# Altium schematic sheet Storage.SchDoc
size A; SheetNumber: 5; SheetTotal: 7
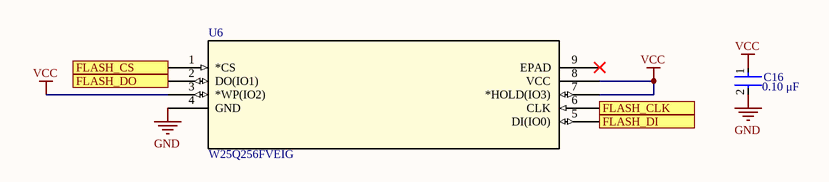
[diagram p0: Storage.SchDoc]

## Parts
C16  Capacitance: 0.10 μF  [FP-C0603C-CF-MFG]  (hidden comment: C0603C104K5RACTU)
U6  W25Q256FVEIG  [WIN_E-8_WIN]

## Ports
FLASH_CLK (in), FLASH_CS (in), FLASH_DI (in), FLASH_DO (out)

## Nets
GND: C16.2 U6.4(GND)
VCC: C16.1 U6.3(*WP(IO2)) U6.7(*HOLD(IO3)) U6.8(VCC)
FLASH_CLK: U6.6(CLK) ; port FLASH_CLK
FLASH_CS: U6.1(*CS) ; port FLASH_CS
FLASH_DI: U6.5(DI(IO0)) ; port FLASH_DI
FLASH_DO: U6.2(DO(IO1)) ; port FLASH_DO

Not connected (* = marked no-connect by the designer): U6 9(EPAD)*

## Library data of the parts
C16 = CMP-2006-03061-2: CAP CER 0.1UF 50V X7R 0603; Manufacturer: KEMET; Tolerance: 0.1; Temperature Coefficient: 30ppm/°C; Material: Ceramic; Automotive Grade: Grade 1; Value: 0.10 μF; Temperature: -55°C to +125°C; RoHS: TRUE; Temperature Range High: +125°C; Lead Free: Yes; Octopart: https://octopart.com/c0603c104k5ractu-kemet-139244; Digikey Description: CAP CER 0.1UF 50V X7R 0603; Category: Cap; Package: C0603C-CF; ComponentLink2Description: Datasheet; Temperature Range Low: -55°C; Device Class L1: Passive Components; Voltage Rating: 50 V; Automotive: Yes; Device Class L3: Ceramic Capacitors; ComponentLink2URL: https://api.kemet.com/component-edge/download/datasheet/C0603C100J5GACAUTO.pdf; Device Class L2: Capacitors; Manufacturer Part Number: C0603C104K5RACTU; Temperature Characteristic: X7R; Height: 0.87mm
U6 = W25Q256FVEIG: No Description Available; Mfr_Name: Winbond; Copyright: Copyright (C) 2022 Ultra Librarian. All rights reserved.; Manufacturer_Part_Number: W25Q256FVEIG; RefDes: RefDes; Type: DEV